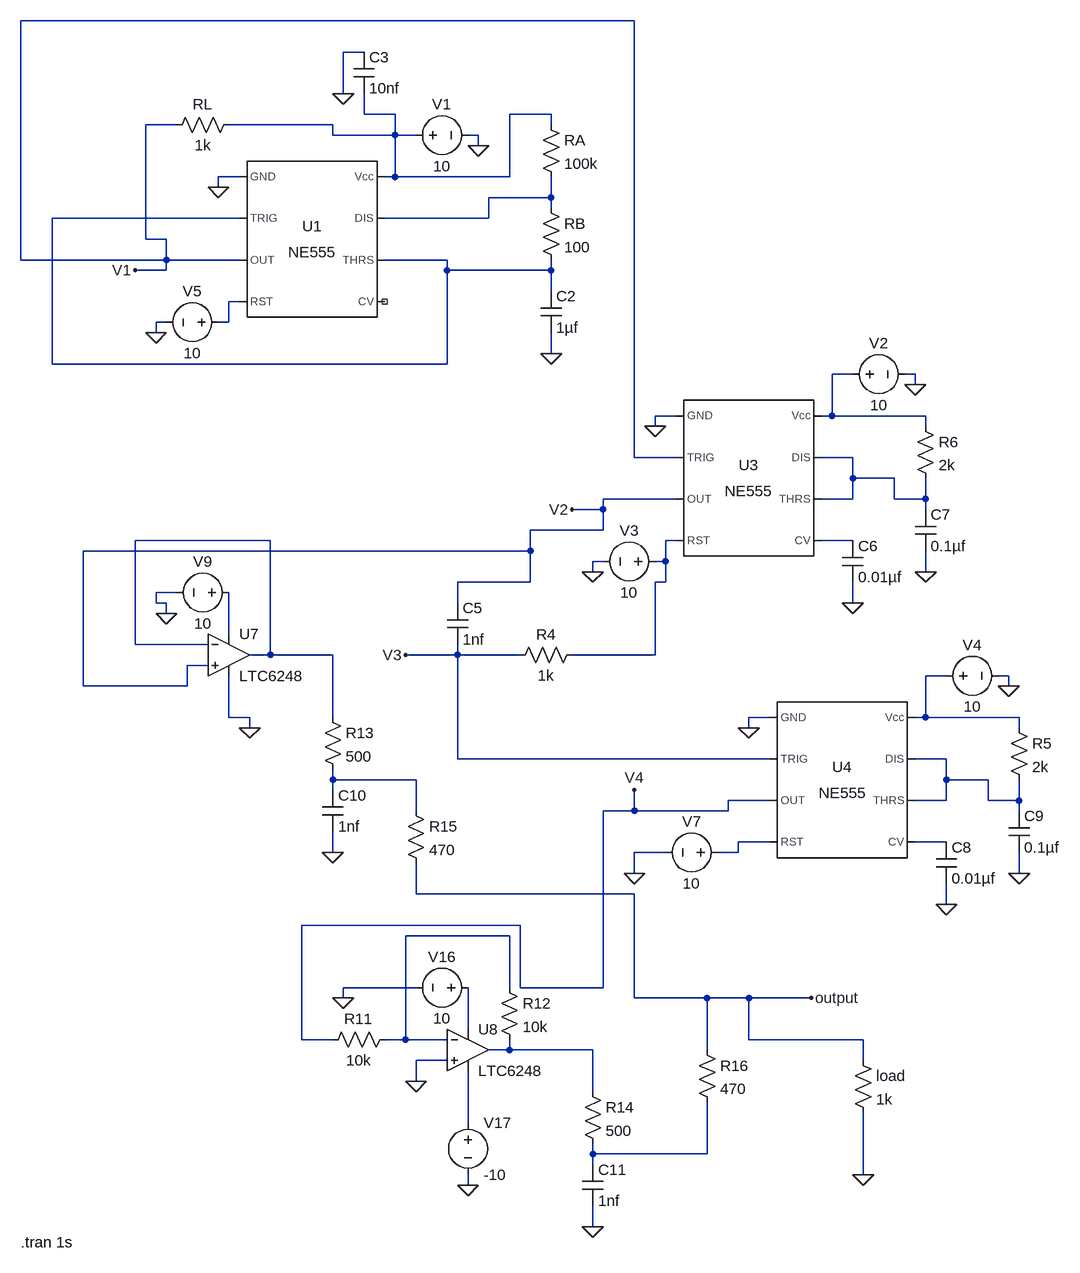
[diagram p0: schematic analogtens_LTspice.asc]
analogtens_LTspice.asc, the LTspice schematic file:
Version 4.1
SHEET 1 1796 1860
WIRE 928 -400 -16 -400
WIRE 512 -352 480 -352
WIRE 480 -288 480 -352
WIRE 512 -256 512 -288
WIRE 560 -256 512 -256
WIRE 800 -256 736 -256
WIRE 224 -240 176 -240
WIRE 464 -240 304 -240
WIRE 800 -240 800 -256
WIRE 464 -224 464 -240
WIRE 560 -224 560 -256
WIRE 560 -224 464 -224
WIRE 592 -224 560 -224
WIRE 688 -224 672 -224
WIRE 688 -208 688 -224
WIRE 320 -160 288 -160
WIRE 560 -160 560 -224
WIRE 560 -160 544 -160
WIRE 736 -160 736 -256
WIRE 736 -160 560 -160
WIRE 288 -144 288 -160
WIRE 800 -128 800 -160
WIRE 800 -128 704 -128
WIRE 800 -112 800 -128
WIRE 320 -96 32 -96
WIRE 704 -96 704 -128
WIRE 704 -96 544 -96
WIRE 176 -64 176 -240
WIRE 208 -64 176 -64
WIRE -16 -32 -16 -400
WIRE 208 -32 208 -64
WIRE 208 -32 -16 -32
WIRE 320 -32 208 -32
WIRE 640 -32 544 -32
WIRE 208 -16 208 -32
WIRE 208 -16 160 -16
WIRE 640 -16 640 -32
WIRE 800 -16 800 -32
WIRE 800 -16 640 -16
WIRE 800 16 800 -16
WIRE 320 32 304 32
WIRE 208 64 192 64
WIRE 304 64 304 32
WIRE 304 64 288 64
WIRE 192 80 192 64
WIRE 800 112 800 80
WIRE 32 128 32 -96
WIRE 640 128 640 -16
WIRE 640 128 32 128
WIRE 1264 144 1232 144
WIRE 1360 144 1344 144
WIRE 1360 160 1360 144
WIRE 992 208 960 208
WIRE 1232 208 1232 144
WIRE 1232 208 1216 208
WIRE 1376 208 1232 208
WIRE 960 224 960 208
WIRE 1376 224 1376 208
WIRE 928 272 928 -400
WIRE 992 272 928 272
WIRE 1264 272 1216 272
WIRE 1264 304 1264 272
WIRE 1328 304 1264 304
WIRE 992 336 880 336
WIRE 1264 336 1264 304
WIRE 1264 336 1216 336
WIRE 1328 336 1328 304
WIRE 1376 336 1376 304
WIRE 1376 336 1328 336
WIRE 880 352 880 336
WIRE 880 352 832 352
WIRE 1376 352 1376 336
WIRE 880 384 880 352
WIRE 880 384 768 384
WIRE 368 400 160 400
WIRE 992 400 976 400
WIRE 1264 400 1216 400
WIRE 768 416 768 384
WIRE 768 416 80 416
WIRE 880 432 864 432
WIRE 976 432 976 400
WIRE 976 432 960 432
WIRE 864 448 864 432
WIRE 1376 448 1376 416
WIRE 768 464 768 416
WIRE 768 464 656 464
WIRE 976 464 976 432
WIRE 976 464 960 464
WIRE 224 480 192 480
WIRE 192 496 192 480
WIRE 208 496 192 496
WIRE 656 496 656 464
WIRE 1264 496 1264 464
WIRE 208 512 208 496
WIRE 304 544 304 480
WIRE 160 560 160 400
WIRE 272 560 160 560
WIRE 368 576 368 400
WIRE 368 576 336 576
WIRE 464 576 368 576
WIRE 656 576 656 560
WIRE 656 576 576 576
WIRE 752 576 656 576
WIRE 960 576 960 464
WIRE 960 576 832 576
WIRE 272 592 240 592
WIRE 1408 608 1376 608
WIRE 1504 608 1488 608
WIRE 80 624 80 416
WIRE 240 624 240 592
WIRE 240 624 80 624
WIRE 1504 624 1504 608
WIRE 304 672 304 608
WIRE 336 672 304 672
WIRE 464 672 464 576
WIRE 1136 672 1104 672
WIRE 1376 672 1376 608
WIRE 1376 672 1360 672
WIRE 1520 672 1376 672
WIRE 336 688 336 672
WIRE 1104 688 1104 672
WIRE 1520 688 1520 672
WIRE 656 736 656 576
WIRE 1136 736 656 736
WIRE 1408 736 1360 736
WIRE 464 768 464 752
WIRE 592 768 464 768
WIRE 1408 768 1408 736
WIRE 1472 768 1408 768
WIRE 464 784 464 768
WIRE 1136 800 1072 800
WIRE 1408 800 1408 768
WIRE 1408 800 1360 800
WIRE 1472 800 1472 768
WIRE 1520 800 1520 768
WIRE 1520 800 1472 800
WIRE 592 816 592 768
WIRE 928 816 928 784
WIRE 928 816 880 816
WIRE 1072 816 1072 800
WIRE 1072 816 928 816
WIRE 1520 816 1520 800
WIRE 1136 864 1088 864
WIRE 1408 864 1360 864
WIRE 464 880 464 848
WIRE 976 880 928 880
WIRE 1088 880 1088 864
WIRE 1088 880 1056 880
WIRE 928 912 928 880
WIRE 1520 912 1520 880
WIRE 592 944 592 896
WIRE 928 944 592 944
WIRE 1408 960 1408 928
WIRE 752 992 416 992
WIRE 736 1008 576 1008
WIRE 592 1088 480 1088
WIRE 736 1088 736 1008
WIRE 752 1088 752 992
WIRE 880 1088 880 816
WIRE 880 1088 752 1088
WIRE 480 1104 480 1088
WIRE 928 1104 928 944
WIRE 1040 1104 928 1104
WIRE 1104 1104 1040 1104
WIRE 1200 1104 1104 1104
WIRE 672 1152 672 1088
WIRE 416 1168 416 992
WIRE 464 1168 416 1168
WIRE 576 1168 576 1008
WIRE 576 1168 544 1168
WIRE 640 1168 576 1168
WIRE 1104 1168 1104 1104
WIRE 1280 1168 1104 1168
WIRE 736 1184 736 1168
WIRE 736 1184 704 1184
WIRE 864 1184 736 1184
WIRE 1040 1184 1040 1104
WIRE 640 1200 592 1200
WIRE 1280 1200 1280 1168
WIRE 592 1232 592 1200
WIRE 864 1248 864 1184
WIRE 672 1296 672 1216
WIRE 864 1344 864 1328
WIRE 1040 1344 1040 1264
WIRE 1040 1344 864 1344
WIRE 864 1360 864 1344
WIRE 1280 1376 1280 1280
WIRE 672 1392 672 1376
WIRE 864 1456 864 1424
FLAG 960 224 0
FLAG 1360 160 0
FLAG 864 448 0
FLAG 1264 496 0
FLAG 1376 448 0
FLAG 832 352 V2
FLAG 288 -144 0
FLAG 688 -208 0
FLAG 192 80 0
FLAG 160 -16 V1
FLAG 480 -288 0
FLAG 800 112 0
FLAG 1104 688 0
FLAG 1504 624 0
FLAG 1408 960 0
FLAG 1520 912 0
FLAG 928 912 0
FLAG 576 576 V3
FLAG 928 784 V4
FLAG 336 688 0
FLAG 208 512 0
FLAG 672 1392 0
FLAG 480 1104 0
FLAG 592 1232 0
FLAG 464 880 0
FLAG 864 1456 0
FLAG 1200 1104 output
FLAG 1280 1376 0
SYMBOL Misc\\NE555 1104 304 R0
SYMATTR InstName U3
SYMBOL voltage 1248 144 R270
WINDOW 0 32 56 VTop 2
WINDOW 3 -32 56 VBottom 2
WINDOW 123 0 0 Left 0
WINDOW 39 0 0 Left 0
SYMATTR InstName V2
SYMATTR Value 10
SYMBOL voltage 976 432 R90
WINDOW 0 -32 56 VBottom 2
WINDOW 3 32 56 VTop 2
WINDOW 123 0 0 Left 0
WINDOW 39 0 0 Left 0
SYMATTR InstName V3
SYMATTR Value 10
SYMBOL cap 1248 400 R0
SYMATTR InstName C6
SYMATTR Value 0.01µf
SYMBOL res 1360 208 R0
SYMATTR InstName R6
SYMATTR Value 2k
SYMBOL cap 1360 352 R0
SYMATTR InstName C7
SYMATTR Value 0.1µf
SYMBOL Misc\\NE555 432 -64 R0
SYMATTR InstName U1
SYMBOL voltage 576 -224 R270
WINDOW 0 32 56 VTop 2
WINDOW 3 -32 56 VBottom 2
WINDOW 123 0 0 Left 0
WINDOW 39 0 0 Left 0
SYMATTR InstName V1
SYMATTR Value 10
SYMBOL voltage 304 64 R90
WINDOW 0 -32 56 VBottom 2
WINDOW 3 32 56 VTop 2
WINDOW 123 0 0 Left 0
WINDOW 39 0 0 Left 0
SYMATTR InstName V5
SYMATTR Value 10
SYMBOL res 784 -128 R0
SYMATTR InstName RB
SYMATTR Value 100
SYMBOL cap 784 16 R0
SYMATTR InstName C2
SYMATTR Value 1µf
SYMBOL cap 496 -352 R0
SYMATTR InstName C3
SYMATTR Value 10nf
SYMBOL res 784 -256 R0
SYMATTR InstName RA
SYMATTR Value 100k
SYMBOL res 320 -256 R90
WINDOW 0 0 56 VBottom 2
WINDOW 3 32 56 VTop 2
SYMATTR InstName RL
SYMATTR Value 1k
SYMBOL cap 640 496 R0
SYMATTR InstName C5
SYMATTR Value 1nf
SYMBOL res 848 560 R90
WINDOW 0 0 56 VBottom 2
WINDOW 3 32 56 VTop 2
SYMATTR InstName R4
SYMATTR Value 1k
SYMBOL Misc\\NE555 1248 768 R0
SYMATTR InstName U4
SYMBOL voltage 1392 608 R270
WINDOW 0 32 56 VTop 2
WINDOW 3 -32 56 VBottom 2
WINDOW 123 0 0 Left 0
WINDOW 39 0 0 Left 0
SYMATTR InstName V4
SYMATTR Value 10
SYMBOL cap 1392 864 R0
SYMATTR InstName C8
SYMATTR Value 0.01µf
SYMBOL res 1504 672 R0
SYMATTR InstName R5
SYMATTR Value 2k
SYMBOL cap 1504 816 R0
SYMATTR InstName C9
SYMATTR Value 0.1µf
SYMBOL voltage 1072 880 R90
WINDOW 0 -32 56 VBottom 2
WINDOW 3 32 56 VTop 2
WINDOW 123 0 0 Left 0
WINDOW 39 0 0 Left 0
SYMATTR InstName V7
SYMATTR Value 10
SYMBOL OpAmps\\LTC6248 304 576 R0
SYMATTR InstName U7
SYMBOL voltage 320 480 R90
WINDOW 0 -32 56 VBottom 2
WINDOW 3 32 56 VTop 2
WINDOW 123 0 0 Left 0
WINDOW 39 0 0 Left 0
SYMATTR InstName V9
SYMATTR Value 10
SYMBOL OpAmps\\LTC6248 672 1184 R0
SYMATTR InstName U8
SYMBOL voltage 688 1088 R90
WINDOW 0 -32 56 VBottom 2
WINDOW 3 32 56 VTop 2
WINDOW 123 0 0 Left 0
WINDOW 39 0 0 Left 0
SYMATTR InstName V16
SYMATTR Value 10
SYMBOL voltage 672 1280 R0
WINDOW 123 0 0 Left 0
WINDOW 39 0 0 Left 0
SYMATTR InstName V17
SYMATTR Value -10
SYMBOL res 560 1152 R90
WINDOW 0 0 56 VBottom 2
WINDOW 3 32 56 VTop 2
SYMATTR InstName R11
SYMATTR Value 10k
SYMBOL res 720 1072 R0
SYMATTR InstName R12
SYMATTR Value 10k
SYMBOL res 448 656 R0
SYMATTR InstName R13
SYMATTR Value 500
SYMBOL cap 448 784 R0
SYMATTR InstName C10
SYMATTR Value 1nf
SYMBOL res 848 1232 R0
SYMATTR InstName R14
SYMATTR Value 500
SYMBOL cap 848 1360 R0
SYMATTR InstName C11
SYMATTR Value 1nf
SYMBOL res 576 800 R0
SYMATTR InstName R15
SYMATTR Value 470
SYMBOL res 1024 1168 R0
SYMATTR InstName R16
SYMATTR Value 470
SYMBOL res 1264 1184 R0
SYMATTR InstName load
SYMATTR Value 1k
TEXT -16 1480 Left 2 !.tran 1s

The netlist it stands for:
* analogtens_LTspice.asc
X§U3 0 V1 V2 N008 N009 N006 N006 N005 NE555  ; pins GND TRIG OUT RST CV THRS DIS Vcc
V2 N005 0 10
V3 N008 0 10
C6 N009 0 0.01µf
R6 N005 N006 2k
C7 N006 0 0.1µf
X§U1 0 N003 V1 N004 NC_01 N003 N002 N001 NE555  ; pins GND TRIG OUT RST CV THRS DIS Vcc
V1 N001 0 10
V5 N004 0 10
RB N002 N003 100
C2 N003 0 1µf
C3 0 N001 10nf
RA N001 N002 100k
RL N001 V1 1k
C5 V2 V3 1nf
R4 N008 V3 1k
X§U4 0 V3 V4 N014 N015 N012 N012 N011 NE555  ; pins GND TRIG OUT RST CV THRS DIS Vcc
V4 N011 0 10
C8 N015 0 0.01µf
R5 N011 N012 2k
C9 N012 0 0.1µf
V7 N014 0 10
* U7: LTC6248 (symbol OpAmps\LTC6248 not available, pins judged from their places): In+=V2 In-=N007 V+=N010 V-=0 OUT=N007
V9 N010 0 10
* U8: LTC6248 (symbol OpAmps\LTC6248 not available, pins judged from their places): In+=0 In-=N016 V+=N017 V-=N019 OUT=N018
V16 N017 0 10
V17 N019 0 -10
R11 N016 V4 10k
R12 N016 N018 10k
R13 N007 N013 500
C10 N013 0 1nf
R14 N018 N020 500
C11 N020 0 1nf
R15 N013 output 470
R16 output N020 470
R§load output 0 1k
.tran 1s
.lib NE555.sub
.backanno
.end